# EAGLE schematic ArduTester (EAGLE 7.6.0)
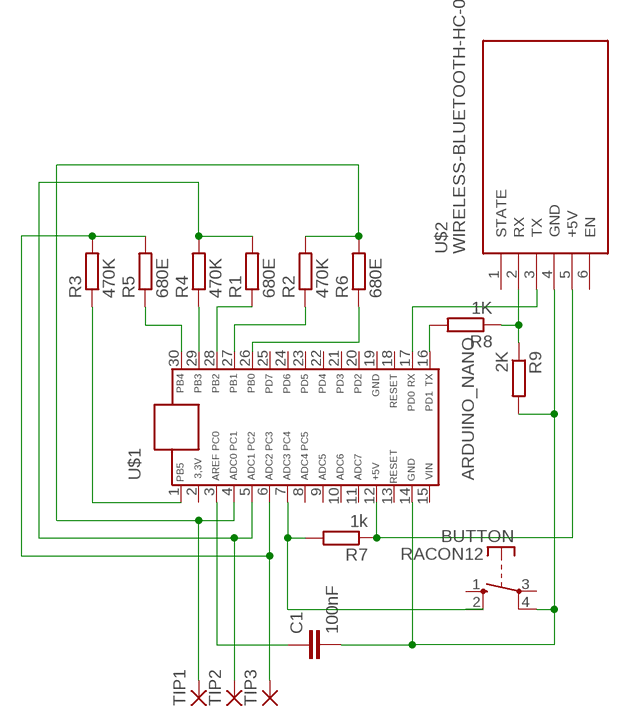
[diagram p0: schematic, sheet 1]

## Parts
BUTTON  RACON12  [RACON12]
C1  100nF  C-EU050-024X044  [C050-024X044]
R1  680E  R-EU_0204/7  [0204/7]
R2  470K  R-EU_0204/7  [0204/7]
R3  470K  R-EU_0204/7  [0204/7]
R4  470K  R-EU_0204/7  [0204/7]
R5  680E  R-EU_0204/7  [0204/7]
R6  680E  R-EU_0204/7  [0204/7]
R7  1k  R-EU_0204/7  [0204/7]
R8  1K  R-EU_0204/7  [0204/7]
R9  2K  R-EU_0204/7  [0204/7]
TIP1  2,54/0,9  [2,54/0,9]
TIP2  2,54/0,9  [2,54/0,9]
TIP3  2,54/0,9  [2,54/0,9]
U$1  ARDUINO_NANO  [ARDUINO_NANO]
U$2  WIRELESS-BLUETOOTH-HC-05  [WIRELESS-BLUETOOTH-HC-05]

## Nets
N$1: R5.1 U$1.30
N$2: R4.1 U$1.29
N$3: R1.1 U$1.28
N$4: R2.1 U$1.27
N$5: R6.1 U$1.26
N$6: R3.1 U$1.1
N$7: R8.2 U$1.16
N$8: BUTTON.4(P) C1.2 R9.2 U$1.14 U$2.4(GND)
N$9: R8.1 R9.1 U$2.2(RX)
N$10: R7.1 U$1.12 U$2.5(+5V)
N$11: C1.1 U$1.3
N$12: BUTTON.2(S) R7.2 U$1.7
N$14: U$1.17 U$2.3(TX)
N$15: R1.2 R4.2 TIP2.1(P) U$1.5
N$18: R3.2 R5.2 TIP3.1(P) U$1.6
N$29: R2.2 R6.2 TIP1.1(P) U$1.4
Unconnected: BUTTON.1(S) BUTTON.3(P) U$1.2 U$1.8 U$1.9 U$1.10 U$1.11 U$1.13 U$1.15 U$1.18 U$1.19 U$1.20 U$1.21 U$1.22 U$1.23 U$1.24 U$1.25 U$2.1(STATE) U$2.6(EN)

## Library data of the parts
BUTTON = jzSwitch-misc:RACON12: ITT SWITCH
C1 = resistor:C-EU: CAPACITOR, European symbol
R1-R9 = resistor:R-EU_: RESISTOR, European symbol
TIP1-TIP3 = wirepad:2,54/0,9: THROUGH-HOLE PAD
U$1 = Drago_elementi:ARDUINO_NANO
U$2 = jzDiy-modules:WIRELESS-BLUETOOTH-HC-05: Bluetooth Transceiver Module based on HC-05 board Tutorial is available here: https://arduino-info.wikispaces.com/BlueTooth-HC05-HC06-Modules-How-To Click here to find device on ebay.com <http://www.ebay.com/sch/hc-05+module+rs232>